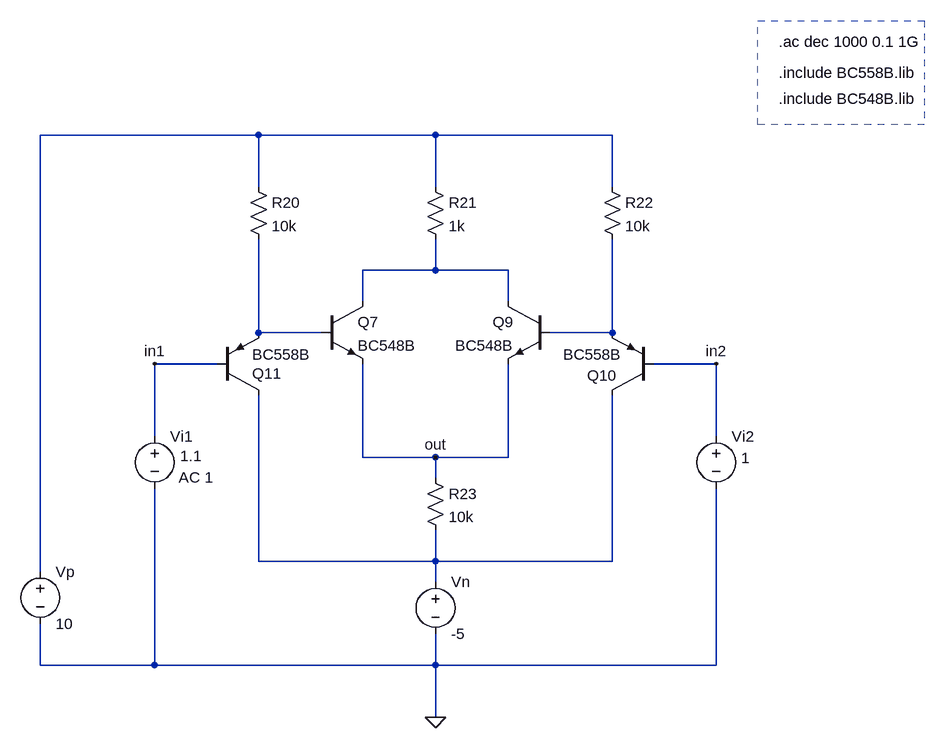
[diagram p0: schematic OR-Q7-9-10-11 -FR.asc]
OR-Q7-9-10-11 -FR.asc, the LTspice schematic file:
Version 4
SHEET 1 1464 852
WIRE 16 -64 -320 -64
WIRE 288 -64 16 -64
WIRE 560 -64 288 -64
WIRE 16 16 16 -64
WIRE 288 16 288 -64
WIRE 560 16 560 -64
WIRE 288 144 288 96
WIRE 288 144 176 144
WIRE 400 144 288 144
WIRE 176 192 176 144
WIRE 400 192 400 144
WIRE 16 240 16 96
WIRE 112 240 16 240
WIRE 560 240 560 96
WIRE 560 240 464 240
WIRE -48 288 -144 288
WIRE 720 288 624 288
WIRE -144 400 -144 288
WIRE 720 400 720 288
WIRE 176 432 176 288
WIRE 288 432 176 432
WIRE 400 432 400 288
WIRE 400 432 288 432
WIRE 288 464 288 432
WIRE 16 592 16 336
WIRE 288 592 288 544
WIRE 288 592 16 592
WIRE 560 592 560 336
WIRE 560 592 288 592
WIRE -320 608 -320 -64
WIRE 288 624 288 592
WIRE -320 752 -320 688
WIRE -144 752 -144 480
WIRE -144 752 -320 752
WIRE 288 752 288 704
WIRE 288 752 -144 752
WIRE 720 752 720 480
WIRE 720 752 288 752
WIRE 288 832 288 752
FLAG 288 832 0
FLAG 288 432 out
FLAG -144 288 in1
FLAG 720 288 in2
SYMBOL npn 112 192 R0
SYMATTR InstName Q7
SYMATTR Value BC548B
SYMBOL npn 464 192 M0
SYMATTR InstName Q9
SYMATTR Value BC548B
SYMBOL res 272 0 R0
SYMATTR InstName R21
SYMATTR Value 1k
SYMBOL res 272 448 R0
SYMATTR InstName R23
SYMATTR Value 10k
SYMBOL voltage -320 592 R0
WINDOW 123 0 0 Left 0
WINDOW 39 0 0 Left 0
SYMATTR InstName Vp
SYMATTR Value 10
SYMBOL voltage -144 384 R0
WINDOW 3 39 46 Left 2
WINDOW 123 37 79 Left 2
WINDOW 39 0 0 Left 0
SYMATTR Value 1.1
SYMATTR Value2 AC 1
SYMATTR InstName Vi1
SYMBOL voltage 720 384 R0
WINDOW 3 38 49 Left 2
SYMATTR InstName Vi2
SYMATTR Value 1
SYMBOL pnp 624 336 R180
WINDOW 0 57 30 Left 2
WINDOW 3 50 62 Left 2
SYMATTR InstName Q10
SYMATTR Value BC558B
SYMBOL pnp -48 336 M180
WINDOW 0 54 33 Left 2
WINDOW 3 54 62 Left 2
SYMATTR InstName Q11
SYMATTR Value BC558B
SYMBOL res 0 0 R0
SYMATTR InstName R20
SYMATTR Value 10k
SYMBOL res 544 0 R0
SYMATTR InstName R22
SYMATTR Value 10k
SYMBOL voltage 288 608 R0
SYMATTR InstName Vn
SYMATTR Value -5
TEXT 816 -208 Left 2 !.ac dec 1000 0.1 1G
TEXT 816 -120 Left 2 !.include BC548B.lib
TEXT 816 -160 Left 2 !.include BC558B.lib
RECTANGLE Normal 1040 -80 784 -240 3

The netlist it stands for:
* OR-Q7-9-10-11 -FR.asc
Q7 N002 N003 out 0 BC548B
Q9 N002 N004 out 0 BC548B
R21 N001 N002 1k
R23 out N005 10k
Vp N001 0 10
Vi1 in1 0 1.1 AC 1
Vi2 in2 0 1
Q10 N005 in2 N004 0 BC558B
Q11 N005 in1 N003 0 BC558B
R20 N001 N003 10k
R22 N001 N004 10k
Vn N005 0 -5
.model NPN NPN
.model PNP PNP
.lib standard.bjt
.ac dec 1000 0.1 1G
.include BC548B.lib
.include BC558B.lib
.backanno
.end